# Altium schematic sheet ftdi_ok.SchDoc
size A3; DocumentNumber: 5; SheetNumber: 5; SheetTotal: 6
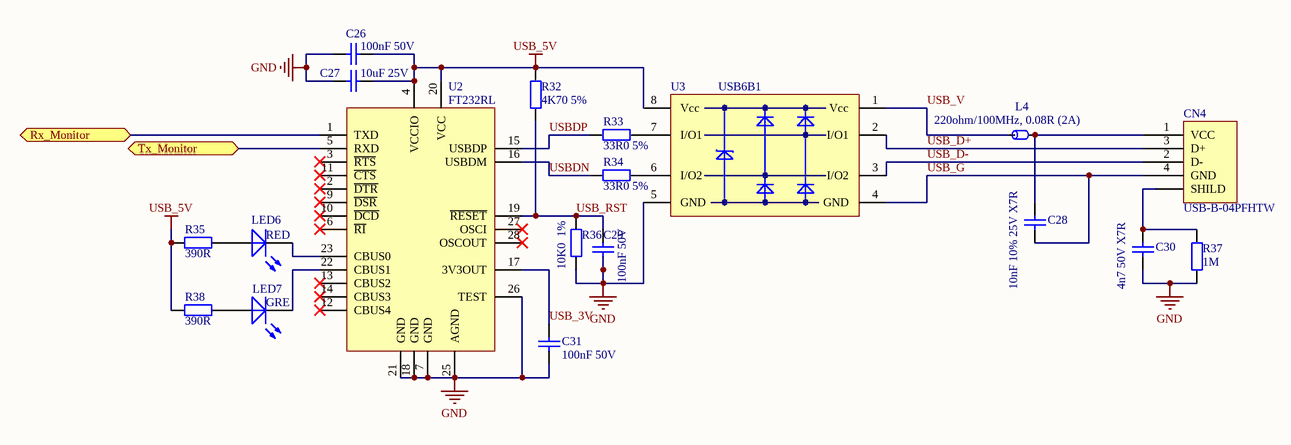
[diagram p0: ftdi_ok.SchDoc]

## Parts
C26  100nF 50V  [0805_C]
C27  10uF 25V  [1206_C]
C28  10nF 10% 25V X7R  [1210_C]
C29  100nF 50V  [0805_C]
C30  4n7 50V X7R  [0805_C]
C31  100nF 50V  [0805_C]
CN4  USB-B-04PFHTW  [USB-B]
L4  220ohm/100MHz, 0.08R (2A)  [0805_R]
LED6  RED  [FP_LED_TH_RED]
LED7  GRE  [FP_LED_TH_GREEN]
R32  4K70 5%  [AXIAL-0.3]
R33  33R0 5%  [AXIAL-0.3]
R34  33R0 5%  [AXIAL-0.3]
R35  390R  [AXIAL-0.3]
R36  10K0  1%  [AXIAL-0.3]
R37  1M  [0805_R]
R38  390R  [AXIAL-0.3]
U2  FT232RL  [SSOP-28]
U3  USB6B1  [SO-8]

## Ports
Rx_Monitor, Tx_Monitor

## Nets
GND: C26.2 C27.2 C29.2 C30.2 C31.2 R36.1 R37.2 U2.7(GND) U2.18(GND) U2.21(GND) U2.25(AGND) U2.26(TEST) U3.5(GND)
USB_5V: C26.1 C27.1 R32.2 R35.1 R38.1 U2.4(VCCIO) U2.20(VCC) U3.8(Vcc)
Rx_Monitor: U2.1(TXD) ; port Rx_Monitor
Tx_Monitor: U2.5(RXD) ; port Tx_Monitor
USB_3V: C31.1 U2.17(3V3OUT)
USB_D+: CN4.3(D+) U3.2(I/O1)
USB_D-: CN4.2(D-) U3.3(I/O2)
USB_G: C28.2 CN4.4(GND) U3.4(GND)
USB_RST: C29.1 R32.1 R36.2 U2.19(~{RESET})
USB_V: L4.2 U3.1(Vcc)
USBDN: R34.2 U2.16(USBDM)
USBDP: R33.2 U2.15(USBDP)
NetC28_1: C28.1 CN4.1(VCC) L4.1
NetC30_1: C30.1 CN4.0(SHILD) R37.1
NetLED6_1: LED6.1(A) R35.2
NetLED6_2: LED6.2(K) U2.23(CBUS0)
NetLED7_1: LED7.1(A) R38.2
NetLED7_2: LED7.2(K) U2.22(CBUS1)
NetR33_1: R33.1 U3.7(I/O1)
NetR34_1: R34.1 U3.6(I/O2)

Not connected (* = marked no-connect by the designer): U2 2(~{DTR})* 3(~{RTS})* 6(~{RI})* 9(~{DSR})* 10(~{DCD})* 11(~{CTS})* 12(CBUS4)* 13(CBUS2)* 14(CBUS3)* 27(OSCI)* 28(OSCOUT)*

## Library data of the parts
C26 C29 C31 = Capacitor_SMD: SMD kondenzátorok; CompType: CC0805KPX7R9BB104; Note: 10% X7R; Distributor: Lomex; Order Code: 82-07-32; Package: 0805; Part Class: Capacitor; Value: 100nF 50V
C27 = Capacitor_SMD: SMD kondenzátorok; K_Manufacturer: (SAM); CompType: CL31A106KAHNNNE; Note: 10% X5R; Distributor: Lomex; Order Code: 82-07-90; Package: 1206; Part Class: Capacitor; Value: 10uF 25V
C28 = Capacitor_SMD: SMD kondenzátorok; CompType: CC0805KRX7R8BB103; Distributor: Lomex; Order Code: 82-05-66; Package: 0805; Part Class: Capacitor; Value: 10nF 10% 25V X7R
C30 = Capacitor_SMD: SMD kondenzátorok; CompType: CC0805KRX7R9BB472; Distributor: Lomex; Order Code: 82-00-71; Package: 0805; Part Class: Capacitor; Value: 4n7 50V X7R
CN4 = USB-B: Part Class: Connector; Note: HORIZONTAL PCB FEMALE NYÁK 90°; Distributor: Lomex; Order Code: 43-14-75; Package: USB-B 4P ANYA 90°; Price: 80; CompType: USB-B-04PFHTW
L4 = Ferrit Bead: SMD Ferrit Bead 220ohm/100MHz; Part Class: Inductivity; CompType: CB05YTYH221; Distributor: Lomex; Order Code: 93-03-48; Package: 0805; Value: 220ohm/100MHz, 0.08R (2A)
LED6 = LED: Part Class: Semiconductor; K_Manufacturer: Kingbright; CompType: KP-3216SRD-PRV; Distributor: Lomex; Order Code: 95-00-28; Package: 1206; Value: RED
LED7 = LED: Part Class: Semiconductor; K_Manufacturer: Kingbright; CompType: KP-3216SGD; Distributor: Lomex; Order Code: 95-00-26; Package: 1206; Value: GRE
R32 = Resistor: K_Manufacturer: Viking Tech Corp.; CompType: CR-05JL7---4K7; Distributor: Lomex; Order Code: 81-10-95; Package: 0805; Part Class: Resistor; Value: 4K70 5%
R33 R34 = Resistor: K_Manufacturer: Viking Tech Corp.; CompType: CR-05JL7---33R; Note: 0.125W; Distributor: Lomex; Order Code: 81-10-69; Package: 0805; Part Class: Resistor; Value: 33R0 5%
R35 R38 = Resistor: K_Manufacturer: Viking Tech Corp.; CompType: CR-05JL7--390R; Distributor: Lomex; Order Code: 81-10-82; Package: 0805; Part Class: Resistor; Value: 390R
R36 = Resistor: K_Manufacturer: Viking Tech Corp.; CompType: CR-05FL7---10K; Distributor: Lomex; Order Code: 80-10-98; Package: 0805; Part Class: Resistor; Value: 10K0  1%
R37 = Resistor: K_Manufacturer: Viking Tech Corp.; CompType: CR-05JL7----1M; K_Note: 0.125W; K_Tolarence: 5%; Distributor: Lomex; Order Code: 81-11-22; Package: 0805; Part Class: Resistor; Value: 1M; K_Description: Resistor; K_Value: 1M; Mounted: Yes; SMD: Yes
U2 = FT232RL: USB - UART IC; K_Manufacturer: (FTD); Note: USB UART IC; CompType: FT232RL; Distributor: Lomex; Order Code: 89-21-46; Package: SSOP-28; Part Class: IC
U3 = USB6B1: Note: TVS diode; Order Code: 687-1075; CompType: USB6B1; Distributor: RS components; Package: SOIC-8; Part Class: TVS diode